# EAGLE design PowerSupply (EAGLE 9.6.2)
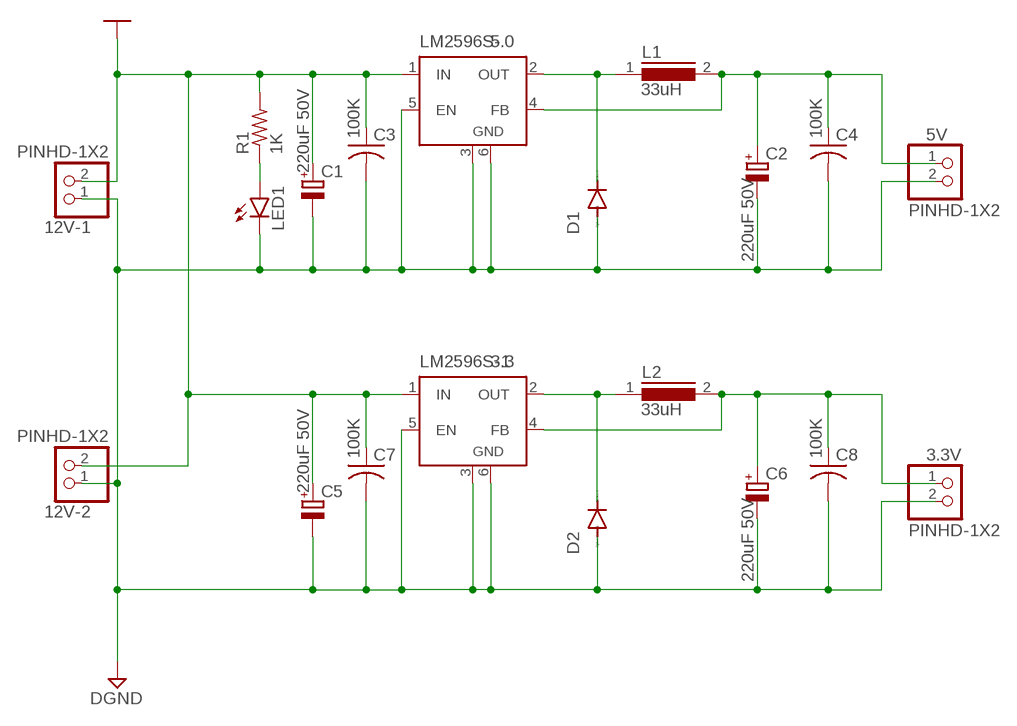
[diagram p0: schematic, sheet 1]

## Parts
3.3V  PINHD-1X2  [1X02]
5V  PINHD-1X2  [1X02]
12V-1  PINHD-1X2  [1X02]
12V-2  PINHD-1X2  [1X02]
C1  220uF 50V  C-POL_ECAP-10.5MM  [CAPAE1030X1050N]
C2  220uF 50V  C-POL_ECAP-10.5MM  [CAPAE1030X1050N]
C3  100K  C-US_CHIP-1206(3216-METRIC)  [CAPC3216X135]
C4  100K  C-US_CHIP-1206(3216-METRIC)  [CAPC3216X135]
C5  220uF 50V  C-POL_ECAP-10.5MM  [CAPAE1030X1050N]
C6  220uF 50V  C-POL_ECAP-10.5MM  [CAPAE1030X1050N]
C7  100K  C-US_CHIP-1206(3216-METRIC)  [CAPC3216X135]
C8  100K  C-US_CHIP-1206(3216-METRIC)  [CAPC3216X135]
D1  DIODE-DO214AA  [DO214AA]
D2  DIODE-DO214AA  [DO214AA]
L1  33uH  SRR1210  [SRR1210]
L2  33uH  SRR1210  [SRR1210]
LED1  LEDCHIPLED_1206  [CHIPLED_1206]
LM2596S-  5.0  LM2596S  [TO263-5]
LM2596S-1  3.3  LM2596S  [TO263-5]
R1  1K  R-US_R1206  [R1206]

## Nets
DGND: 3.3V.2 5V.2 12V-1.1 12V-2.1 C1.2(-) C2.2(-) C3.2 C4.2 C5.2(-) C6.2(-) C7.2 C8.2 D1.A D2.A LED1.C LM2596S-1.3(GND) LM2596S-1.5(EN) LM2596S-1.6(GND) LM2596S-.3(GND) LM2596S-.5(EN) LM2596S-.6(GND)
N$1: LED1.A R1.1
N$2: D1.C L1.1 LM2596S-.2(OUT)
N$3: 5V.1 C2.1(+) C4.1 L1.2 LM2596S-.4(FB)
N$4: D2.C L2.1 LM2596S-1.2(OUT)
N$6: 3.3V.1 C6.1(+) C8.1 L2.2 LM2596S-1.4(FB)
VCC: 12V-1.2 12V-2.2 C1.1(+) C3.1 C5.1(+) C7.1 LM2596S-1.1(IN) LM2596S-.1(IN) R1.2

## Library data of the parts
3.3V 5V 12V-1 12V-2 = Connector:PINHD-1X2: PIN HEADER; CATEGORY: CONNECTOR; SUB-CATEGORY: PIN-HEADER
C1 C2 C5 C6 = Capacitor:C-POL: Capacitor Polarised - Generic; CATEGORY: Capacitor
C3 C4 C7 C8 = Capacitor:C-US: Capacitor - ANSI; CATEGORY: Capacitor
D1 D2 = diode:DIODE-: DIODE
L1 L2 = inductors-2:SRR1210: SRR1210 Series - Shielded SMD Power Inductors Features : Available in E12 series Height of 4.3 mm Current rating up to 9 A RoHS compliant Applications : Input/output of DC/DC converters Power supplies
LED1 = led:LED: LED OSRAM: - CHIPLED LG R971, LG N971, LY N971, LG Q971, LY Q971, LO R971, LY R971 LH N974, LH R974 LS Q976, LO Q976, LY Q976 LO Q996 - Hyper CHIPLED LW Q18S LB Q993, LB Q99A, LB R99A - SideLED LS A670, LO A670, LY A670, LG A670, LP A670 LB A673, LV A673, LT A673, LW A673 LH A674 LY A675 LS A676, LA A676, LO A676, LY A676, LW A676 LS A679, LY A679, LG A679 - Hyper Micro SIDELED® LS Y876, LA Y876, LO Y876, LY Y876 LT Y87S - SmartLED LW L88C, LW L88S LB L89C, LB L89S, LG L890 LS L89K, LO L89K, LY L89K LS L896, LA L896, LO L896, LY L896 - TOPLED LS T670, LO T670, LY T670, LG T670, LP T670 LSG T670, LSP T670, LSY T670, LOP T670, LYG T670 LG T671, LOG T671, LSG T671 LB T673, LV T673, LT T673, LW T673 LH T674 LS T676, LA T676, LO T676, LY T676, LB T676, LH T676, LSB T676, LW T676 LB T67C, LV T67C, LT T67C, LS T67K, LO T67K, LY T67K, LW E67C LS E67B, LA E67B, LO E67B, LY E67B, LB E67C, LV E67C, LT E67C LW T67C LS T679, LY T679, LG T679 LS T770, LO T770, LY T770, LG T770, LP T770 LB T773, LV T773, LT T773, LW T773 LH T774 LS E675, LA E675, LY E675, LS T675 LS T776, LA T776, LO T776, LY T776, LB T776 LHGB T686 LT T68C, LB T68C - Hyper Mini TOPLED® LB M676 - Mini TOPLED Santana® LG M470 LS M47K, LO M47K, LY M47K Source: http://www.osram.convergy.de LUXEON: - LUMILED® LXK2-PW12-R00, LXK2-PW12-S00, LXK2-PW14-U00, LXK2-PW14-V00 LXK2-PM12-R00, LXK2-PM12-S00, LXK2-PM14-U00 LXK2-PE12-Q00, LXK2-PE12-R00, LXK2-PE12-S00, LXK2-PE14-T00, LXK2-PE14-U00 LXK2-PB12-K00, LXK2-PB12-L00, LXK2-PB12-M00, LXK2-PB14-N00, LXK2-PB14-P00, LXK2-PB14-Q00 LXK2-PR12-L00, LXK2-PR12-M00, LXK2-PR14-Q00, LXK2-PR14-R00 LXK2-PD12-Q00, LXK2-PD12-R00, LXK2-PD12-S00 LXK2-PH12-R00, LXK2-PH12-S00 LXK2-PL12-P00, LXK2-PL12-Q00, LXK2-PL12-R00 Source: www.luxeon.com KINGBRIGHT: KA-3528ASYC Source: www.kingbright.com
LM2596S- LM2596S-1 = linear:LM2596S: STEP-DOWN VOLTAGE REGULATOR
R1 = resistor:R-US_: RESISTOR, American symbol

## Net classes
0 default: width 0.762 mm, clearance 0.508 mm

## Board
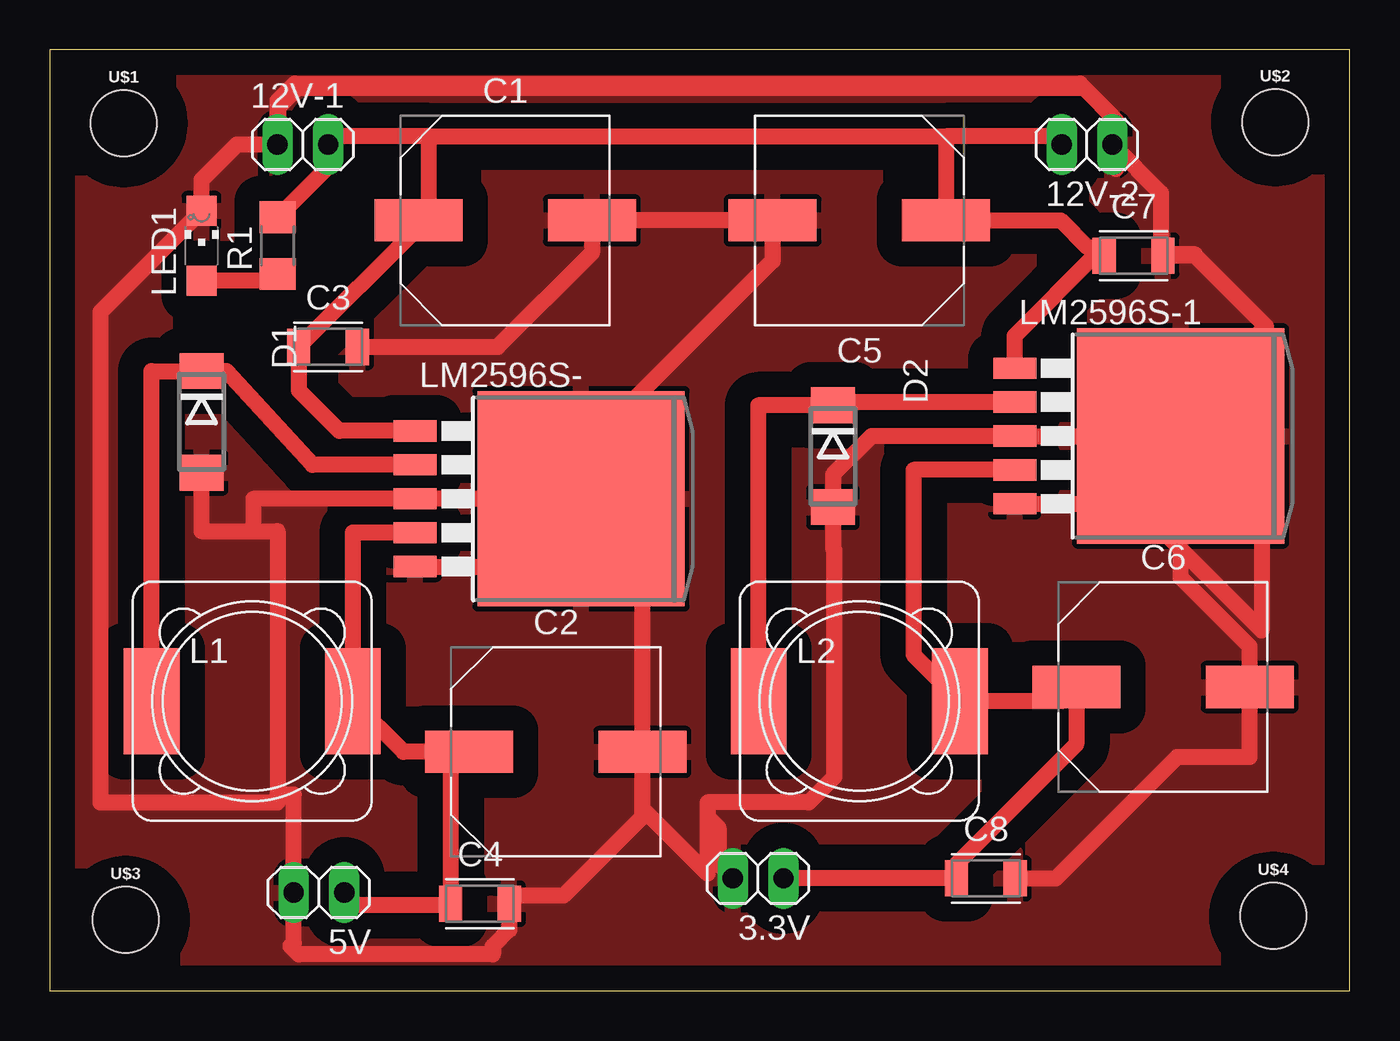
[diagram p1: board, top side]

Size 65.26 x 47.22 mm. Coordinates in mm from the lower left corner, seen from the top.
Outline: 0,0 65.26,0 65.26,47.22 0,47.22 0,0
Copper layers (1*16): Top 0.035mm / dielectric 1.5mm / Bottom 0.035mm
Design rules "default": minimum track width 6mil, minimum drill 0.35mm, track to track 6mil, track to pad 6mil, pad to pad 6mil, via to via 6mil, smd to smd 6mil, copper to edge 40mil, drill to drill 6mil, minimum pad ring 10mil, minimum via ring 8mil, stop-mask expansion 4mil, vias tented up to drill 0mil, thermal gap 10mil

### Footprints (pad centres in the part's own frame; a part is rotated, then mirrored left to right if it is on the bottom)
1X02 = drill 1.016 long: 1 -1.27,0; 2 1.27,0
CAPAE1030X1050N = smd 4.416 x 2.115: 1 -4.353,0; 2 4.353,0
CAPC3216X135 = smd 1.165 x 1.815: 1 -1.475,0; 2 1.475,0
DO214AA = smd 1.8 x 2.2: A 2.55,0; C -2.55,0
SRR1210 = smd 2.8 x 5.3: 1 -5.05,0; 2 5.05,0
CHIPLED_1206 = smd 1.5 x 1.5: A 0,-1.75; C 0,1.75
TO263-5 = smd 1.067 x 2.159: 1 -3.404,-5.791; 2 -1.702,-5.791; 3 0,-5.791; 4 1.702,-5.791; 5 3.404,-5.791 | smd 10.8 x 10.41: 6 0,2.54
R1206 = smd 1.6 x 1.803: 1 -1.422,0; 2 1.422,0
STAND-OFF = hole 3.302: 0,0

### Placement (x,y rotation side)
3.3V  35.56,5.64 180 top
5V  13.51,4.93 180 top
12V-1  12.7,42.47 0 top
12V-2  52.07,42.47 180 top
C1  22.86,38.66 0 top
C2  25.4,11.99 0 top
C3  13.97,32.31 0 top
C4  21.59,4.37 0 top
C5  40.64,38.66 180 top
C6  55.88,15.24 0 top
C7  54.41,36.88 0 top
C8  46.99,5.64 0 top
D1  7.62,28.55 270 top
D2  39.32,26.82 270 top
L1  10.16,14.53 0 top
L2  40.64,14.53 0 top
LED1  7.62,37.39 0 top
LM2596S-  24.13,24.69 270 top
LM2596S-1  54.23,27.84 270 top
R1  11.43,37.39 90 top
U$1  [STAND-OFF]  3.71,43.54 0 top
U$2  [STAND-OFF]  61.52,43.59 0 top
U$3  [STAND-OFF]  3.81,3.56 0 top
U$4  [STAND-OFF]  61.42,3.76 0 top

### Tracks (layer width: path | path; a pad name or v marks a point on that pad's centre or on a via)
DGND
  Top 0.813: 35.77,38.66 C5.2 | LM2596S-.6 27.23,24.13 27.23,23.42 | LM2596S-.6 27.23,24.69 | LM2596S-.5 24.23,21.28 26.37,23.42 26.37,22.15 25.1,20.88 26.67,20.88 LM2596S-.6 | C2.2 29.75,21.61 LM2596S-.6 | 12V-1.1 9.4,42.47 7.62,40.69 LED1.C 2.54,34.06 2.54,9.45 11.43,9.45 11.43,9.85 | C5.2 36.29,36.63 29.21,29.55 29.21,27.23 | 29.21,27.23 29.21,24.69 | 57.51,36.95 55.96,36.95 C7.2 | C7.2 55.78,36.88 55.78,40.03 12V-2.1 53.34,43.89 51.71,45.52 12.29,45.52 11.43,44.65 12V-1.1 | LM2596S-1.6 59.64,27.84 | C5.2 C1.2 27.21,37.03 22.49,32.31 C3.2 | 11.43,9.85 12.25,9.85 12.24,9.84 5V.2 12.24,2.39 12.09,2.23 12.5,1.83 22.25,1.83 22.25,2.23 23.07,3.05 C4.2 23.47,4.77 25.79,4.77 29.75,8.74 C2.2 | D1.A 7.62,23.06 10.21,23.06 | 10.21,23.06 10.21,24.69 LM2596S-.3 LM2596S-.6 | 11.43,9.85 11.43,23.06 10.21,23.06 | 3.3V.2 33.56,6.37 33.56,8.18 33.02,8.72 | C2.2 29.75,9.14 33.02,5.88 33.02,8.72 | 56.77,22.15 56.77,20.74 60.23,17.27 C6.2 60.23,11.73 56.59,11.73 50.5,5.64 C8.2 | LM2596S-1.6 60.83,23.77 60.83,18.08 56.77,22.15 | LM2596S-1.5 54.48,24.43 56.77,22.15 | LM2596S-1.6 LM2596S-1.3 41.25,27.84 39.32,25.91 D2.A 39.32,22.2 39.37,22.15 39.37,10.72 38.1,9.45 33.02,9.45 33.02,8.72 | C7.2 57.51,36.88 61.05,33.34 56.77,29.06 LM2596S-1.6 | LM2596S-.6 29.21,27.23 | 53.54,41.25 53.54,43.67 51.9,45.31 12.46,45.31 11.48,44.33 11.48,42.52 12V-1.1
  pour Top (isolate 1.27): -0.1,47.35 65.33,47.35 65.33,-0.2 -0.1,-0.2
N$1
  Top 0.813: R1.1 11.1,35.64 LED1.A
N$2
  Top 0.813: LM2596S-.2 13.18,26.39 8.87,31.1 D1.C 5.11,31.1 L1.1
N$3
  Top 0.813: LM2596S-.4 15.21,22.99 L1.2 17.75,11.99 C2.1 | C2.1 20.12,11.06 C4.1 20.12,4.32 15.39,4.32 5V.1 | 21.59,11.99 C2.1
N$4
  Top 0.813: LM2596S-1.2 39.49,29.54 D2.C 35.56,29.37 35.56,14.56 L2.1
N$6
  Top 0.813: LM2596S-1.4 43.36,26.14 43.36,16.86 L2.2 50.82,14.53 C6.1 51.53,12.36 45.52,6.35 C8.1 3.3V.1
VCC
  Top 0.813: 19.05,42.87 14.38,42.87 12V-1.2 13.97,41.35 R1.2 | 19.05,42.87 44.99,42.87 | 44.99,42.87 C5.1 50.75,38.66 52.12,37.29 52.52,37.29 C7.1 52.86,36.95 52.52,36.95 48.44,32.87 LM2596S-1.1 | 19.05,42.87 19.05,38.66 C1.1 18.51,38.32 C3.1 12.5,30.13 14.53,28.09 LM2596S-.1 | 12V-2.2 50.39,42.87 44.99,42.87